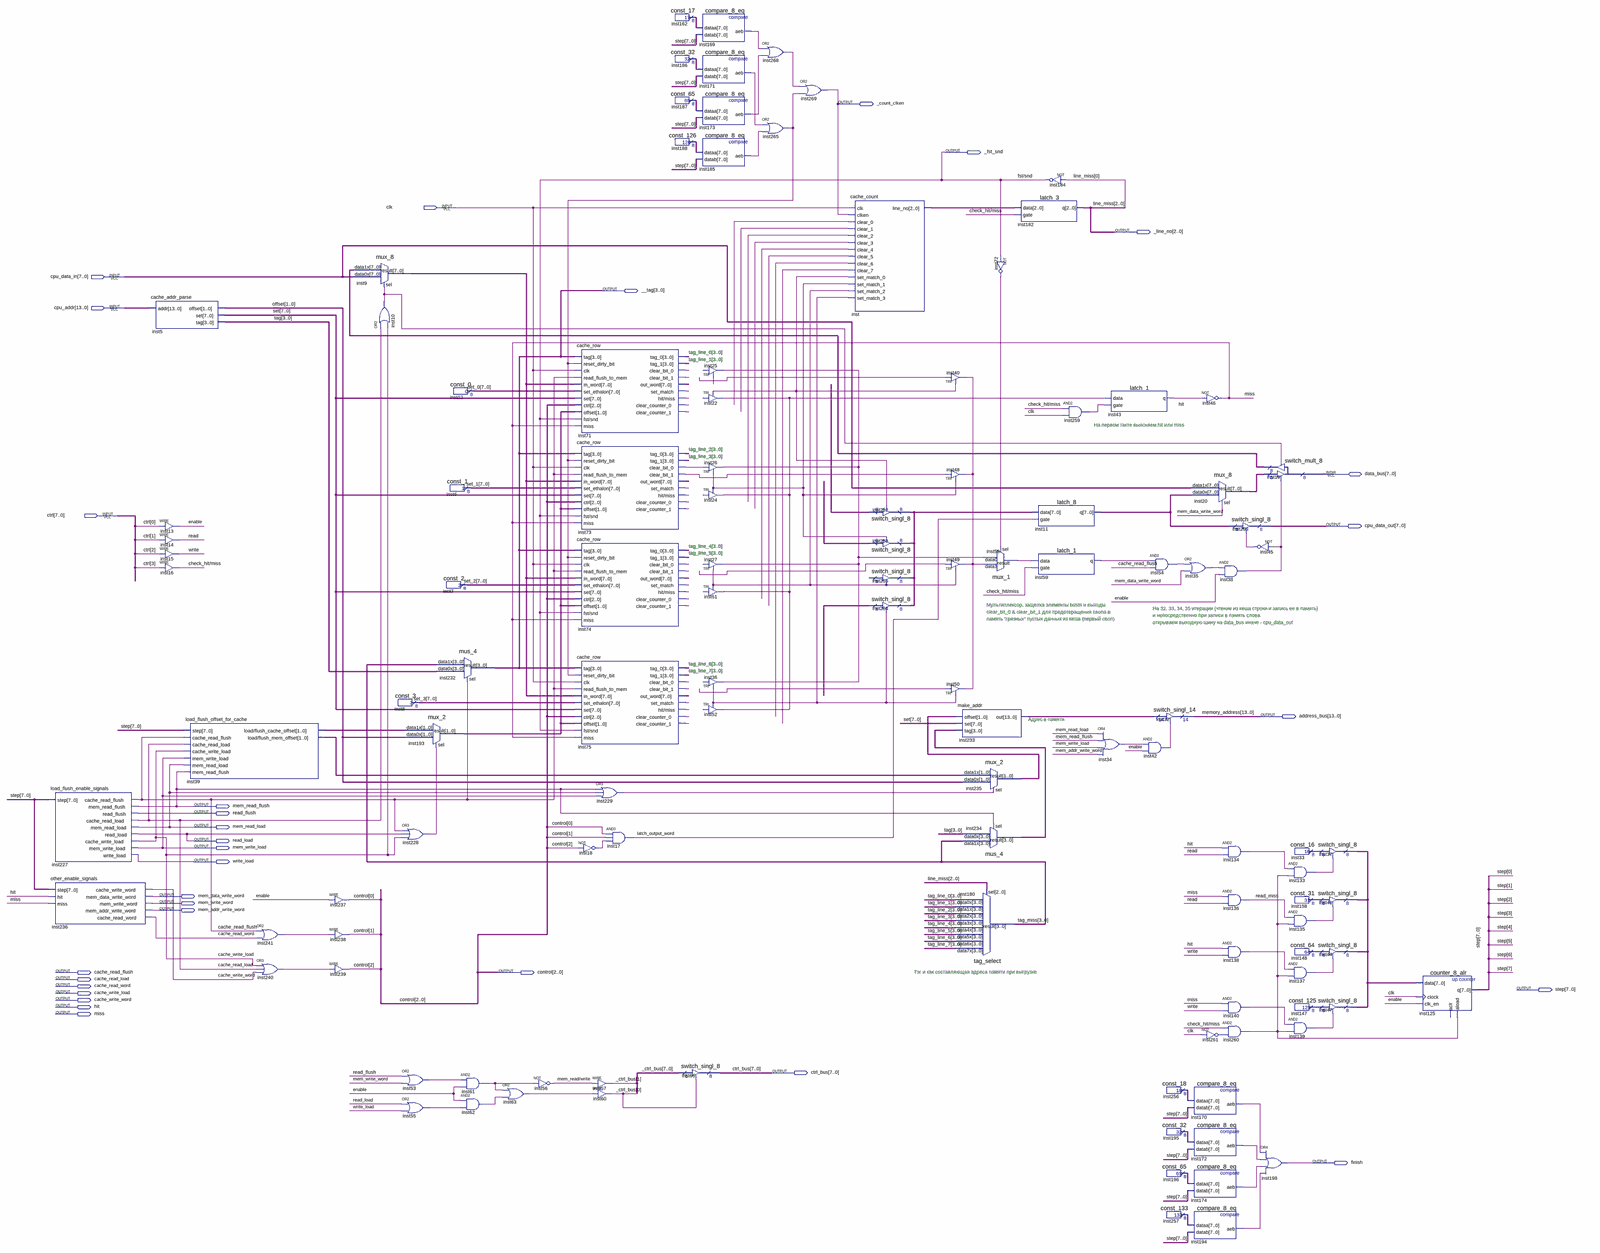
[diagram p0: schematic sheet, whole]
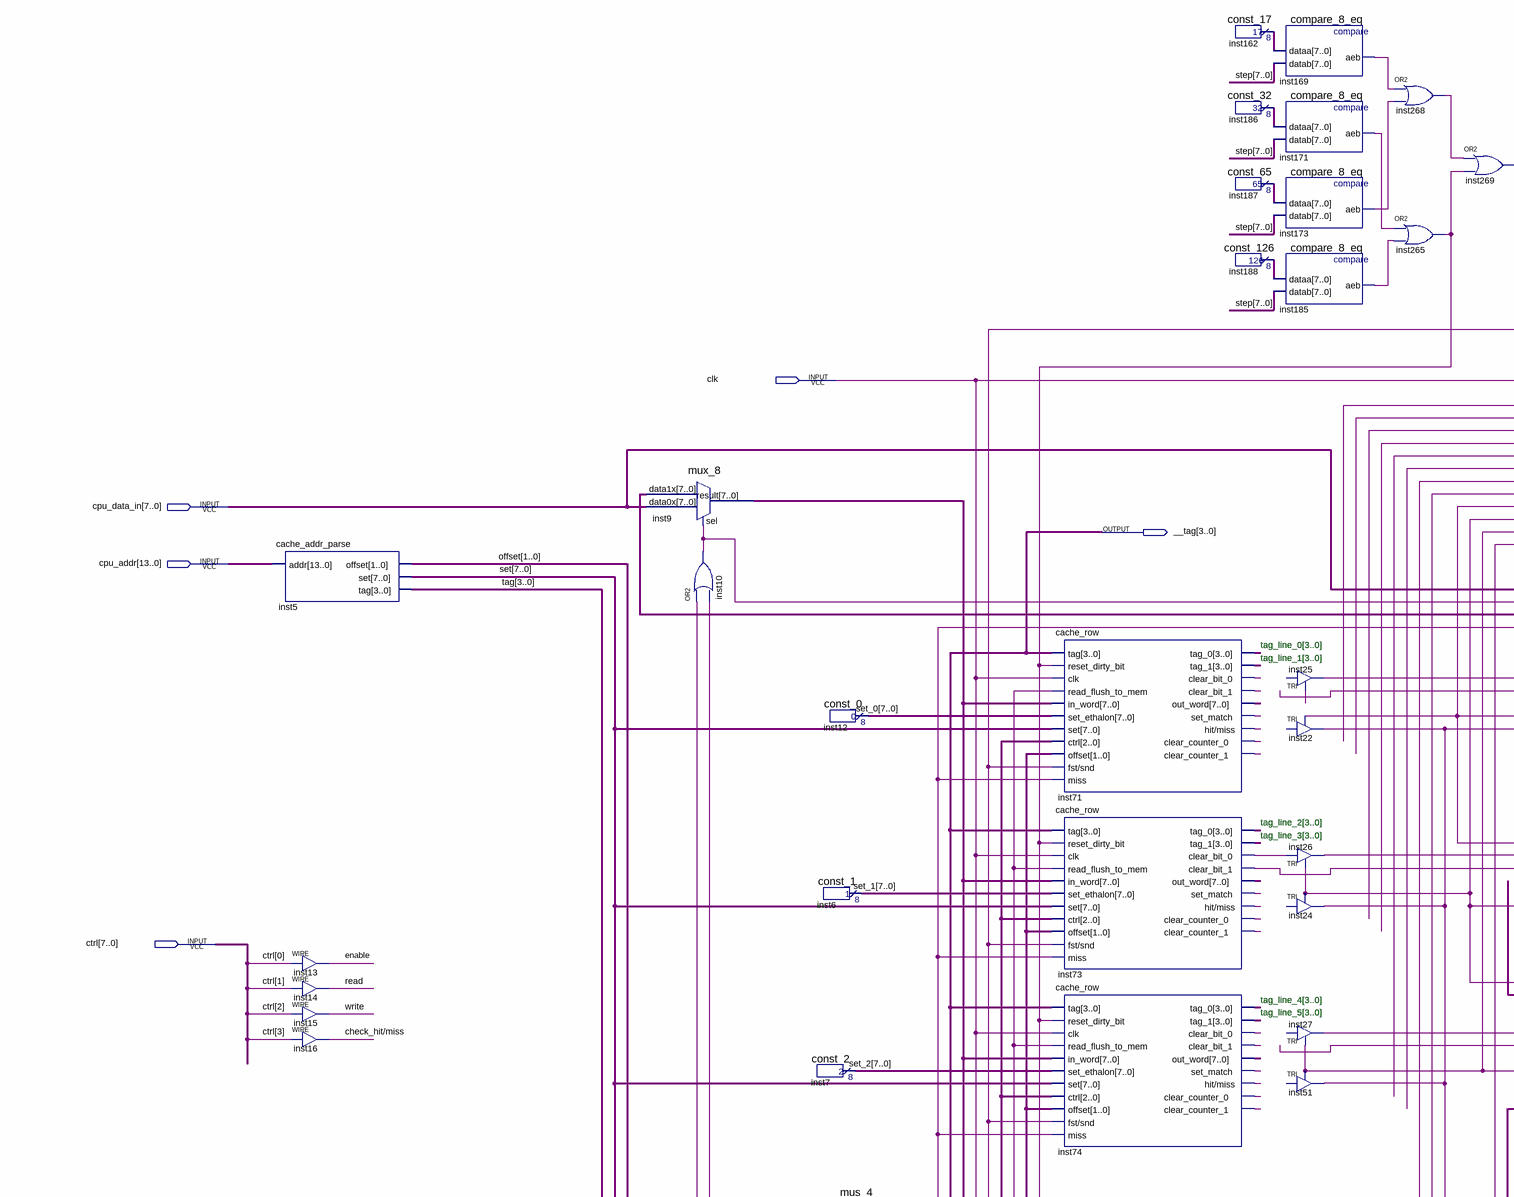
[diagram p1: schematic sheet, upper left part]
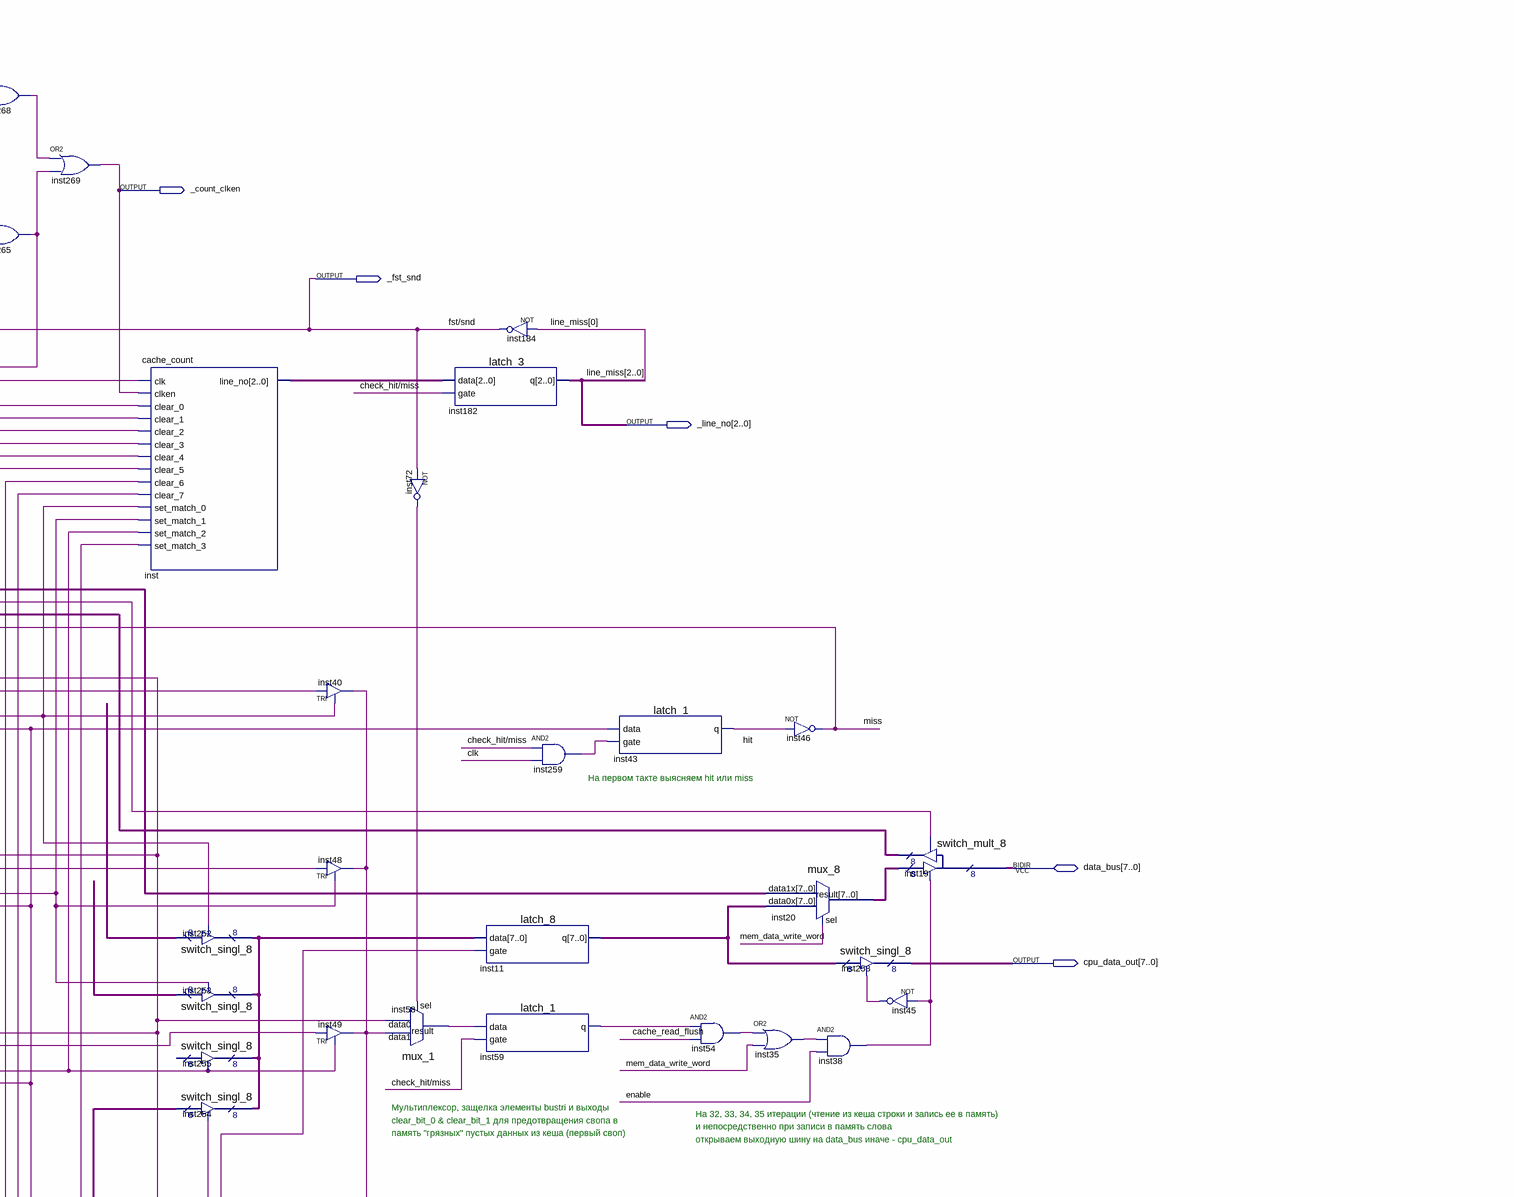
[diagram p2: schematic sheet, upper right part]
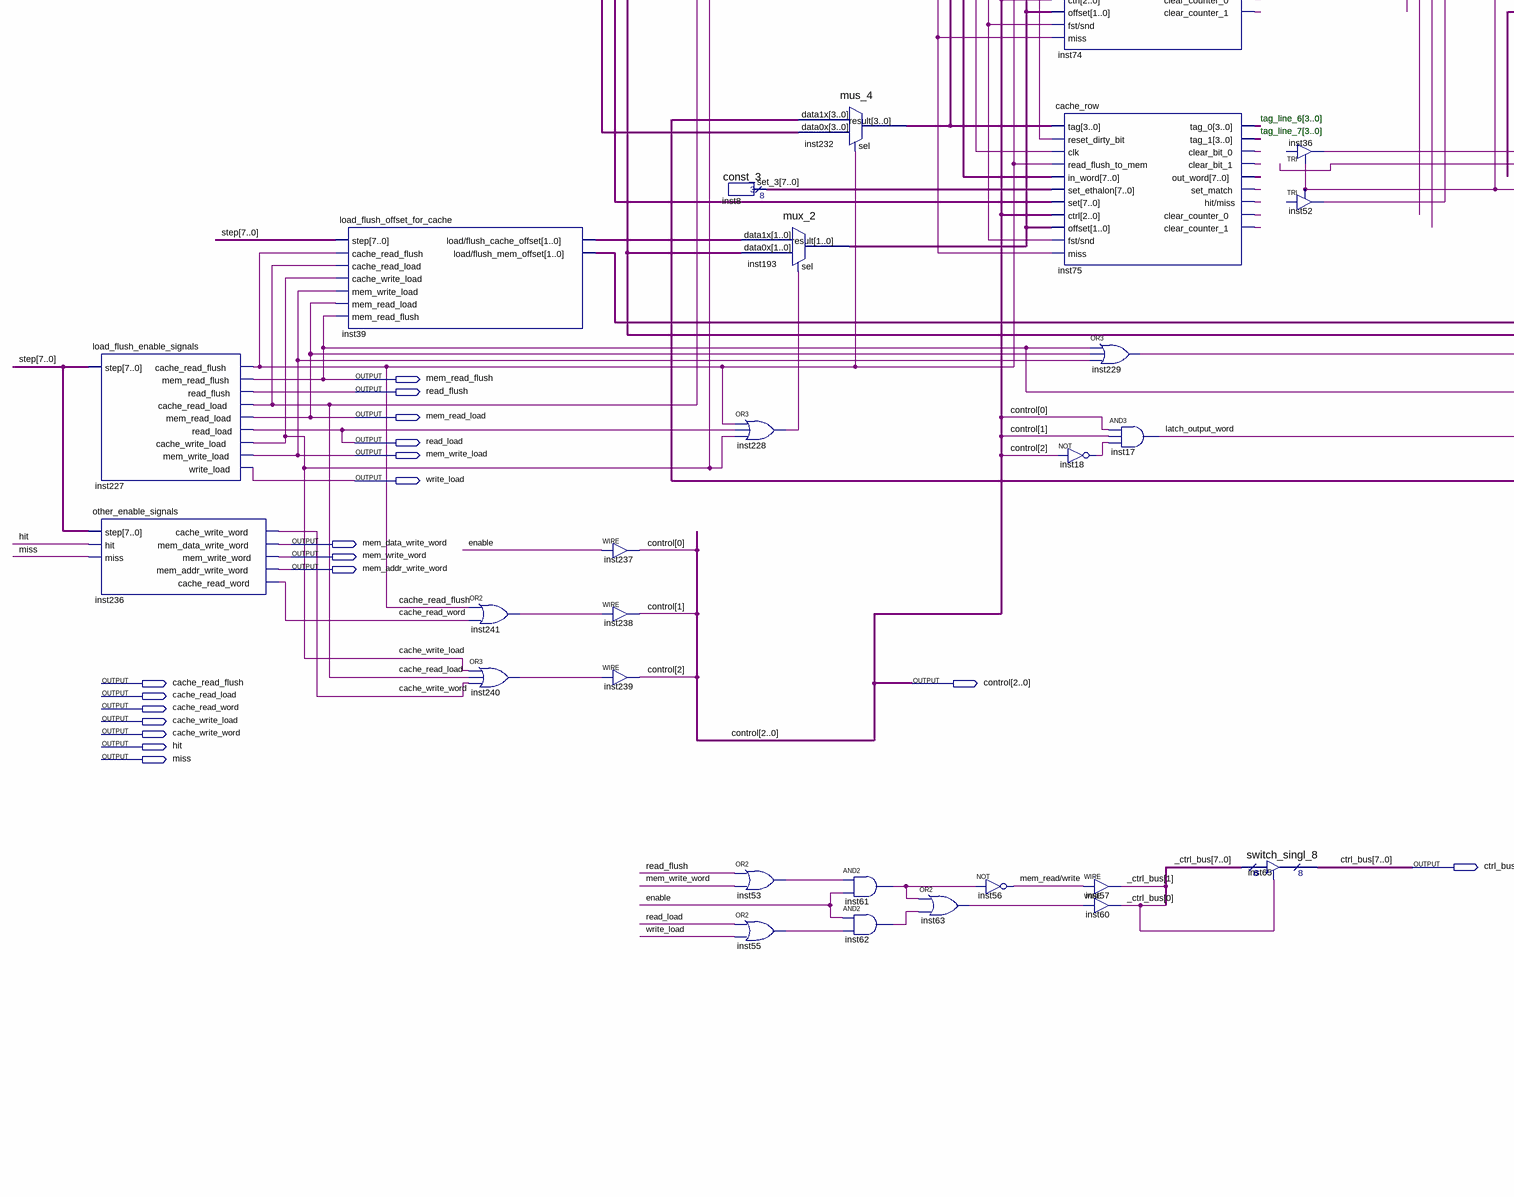
[diagram p3: schematic sheet, lower left part]
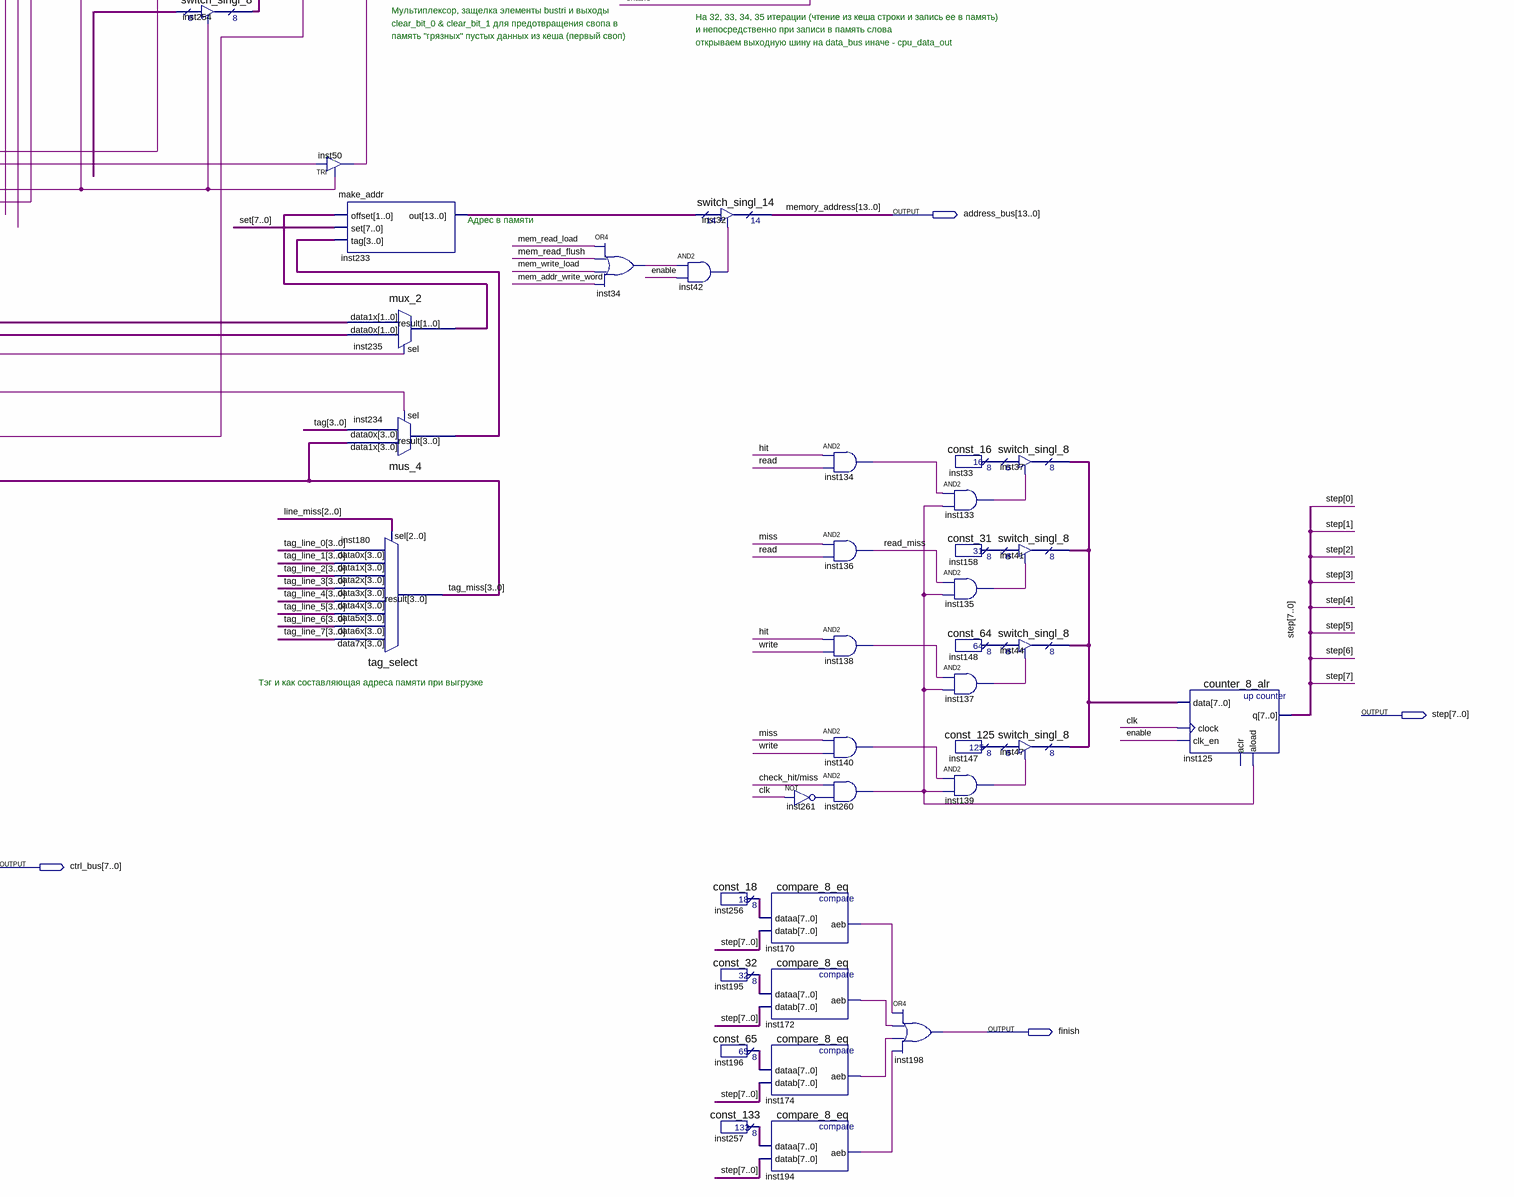
[diagram p4: schematic sheet, lower right part]
// Quartus schematic cache_all_pins.bdf as structural Verilog: 117 symbols, 31 pins
module cache_all_pins (
  input  clk,
  input  [7:0] cpu_data_in,
  input  [13:0] cpu_addr,
  input  [7:0] ctrl,
  inout  [7:0] data_bus,
  output _count_clken,
  output _fst_snd,
  output [2:0] _line_no,
  output [3:0] __tag,
  output [7:0] cpu_data_out,
  output [13:0] address_bus,
  output mem_read_flush,
  output read_flush,
  output mem_read_load,
  output read_load,
  output mem_write_load,
  output write_load,
  output mem_data_write_word,
  output mem_write_word,
  output mem_addr_write_word,
  output cache_read_flush,
  output [2:0] control,
  output cache_read_load,
  output cache_read_word,
  output [7:0] step,
  output cache_write_load,
  output cache_write_word,
  output hit,
  output miss,
  output [7:0] ctrl_bus,
  output finish
);

  wire \check_hit/miss , enable, inst10_out, inst18_out, inst22_out, inst25_out, inst34_out, inst35_out,
       inst38_out, inst40_out, inst42_out, inst45_out, inst53_out, inst54_out, inst55_out, inst58_result,
       inst59_q, inst61_out, inst62_out, inst63_out, inst71_clear_bit_0, inst71_clear_bit_1,
       inst71_clear_counter_0, inst71_clear_counter_1, inst71_hit_miss, inst71_set_match, inst72_out,
       inst73_clear_bit_0, inst73_clear_bit_1, inst73_clear_counter_0, inst73_clear_counter_1,
       inst73_hit_miss, inst73_set_match, inst74_clear_bit_0, inst74_clear_bit_1, inst74_clear_counter_0,
       inst74_clear_counter_1, inst74_hit_miss, inst74_set_match, inst75_clear_bit_0, inst75_clear_bit_1,
       inst75_clear_counter_0, inst75_clear_counter_1, inst75_hit_miss, inst75_set_match, inst133_out,
       inst134_out, inst135_out, inst137_out, inst138_out, inst139_out, inst140_out, inst169_aeb,
       inst170_aeb, inst171_aeb, inst172_aeb, inst173_aeb, inst174_aeb, inst185_aeb, inst194_aeb,
       inst228_out, inst229_out, inst240_out, inst241_out, inst259_out, inst260_out, inst261_out,
       inst265_out, inst268_out, latch_output_word, \mem_read/write , read, read_miss, undriven, undriven_2,
       undriven_3, undriven_4, undriven_5, undriven_6, undriven_7, undriven_8, undriven_9, undriven_10,
       undriven_11, undriven_12, undriven_13, undriven_15, undriven_17, undriven_19, write;
  wire [1:0] inst39_load_flush_cache_offset, inst39_load_flush_mem_offset, inst193_result, inst235_result,
       offset;
  wire [2:0] inst_line_no;
  wire [3:0] inst234_result, tag, tag_line_0, tag_line_1, tag_line_2, tag_line_3, tag_line_4, tag_line_5,
       tag_line_6, tag_line_7, tag_miss;
  wire [7:0] _ctrl_bus, inst9_result, inst11_q, inst19_result, inst20_result, inst33_result, inst37_tridata,
       inst71_out_word, inst73_out_word, inst74_out_word, inst75_out_word, inst147_result, inst148_result,
       inst158_result, inst162_result, inst186_result, inst187_result, inst188_result, inst195_result,
       inst196_result, inst252_tridata, inst256_result, inst257_result, set, set_0, set_1, set_2, set_3,
       undriven_14, undriven_16, undriven_18;
  wire [13:0] inst233_out;

  load_flush_enable_signals inst227 (
    .step(step), .cache_read_flush(cache_read_flush), .mem_read_flush(mem_read_flush),
    .read_flush(read_flush), .cache_read_load(cache_read_load), .mem_read_load(mem_read_load),
    .read_load(read_load), .cache_write_load(cache_write_load), .mem_write_load(mem_write_load),
    .write_load(write_load));
  other_enable_signals inst236 (
    .step(step), .hit(hit), .miss(miss), .cache_write_word(cache_write_word),
    .mem_data_write_word(mem_data_write_word), .mem_write_word(mem_write_word),
    .mem_addr_write_word(mem_addr_write_word), .cache_read_word(cache_read_word));
  cache_addr_parse inst5 (.addr(cpu_addr), .offset(offset), .set(set), .tag(tag));
  assign enable = ctrl[0];  // WIRE inst13
  assign read = ctrl[1];  // WIRE inst14
  assign write = ctrl[2];  // WIRE inst15
  assign \check_hit/miss  = ctrl[3];  // WIRE inst16
  load_flush_offset_for_cache inst39 (
    .step(step), .cache_read_flush(cache_read_flush), .cache_read_load(cache_read_load),
    .cache_write_load(cache_write_load), .mem_write_load(mem_write_load), .mem_read_load(mem_read_load),
    .mem_read_flush(mem_read_flush), .\load/flush_cache_offset (inst39_load_flush_cache_offset),
    .\load/flush_mem_offset (inst39_load_flush_mem_offset));
  or inst241 (inst241_out, cache_read_flush, cache_read_word);
  or inst240 (inst240_out, cache_write_load, cache_read_load, cache_write_word);
  assign control[0] = enable;  // WIRE inst237
  assign control[1] = inst241_out;  // WIRE inst238
  assign control[2] = inst240_out;  // WIRE inst239
  mux_8 inst9 (.data1x(inst19_result), .data0x(cpu_data_in), .sel(inst10_out), .result(inst9_result));
  or inst10 (inst10_out, cache_read_load, cache_write_load);
  const_3 inst8 (.result(set_3));
  or inst228 (inst228_out, cache_read_flush, read_load, cache_write_load);
  or inst53 (inst53_out, read_flush, mem_write_word);
  or inst55 (inst55_out, read_load, write_load);
  mux_2 inst193 (.data1x(inst39_load_flush_cache_offset), .data0x(offset), .sel(inst228_out), .result(inst193_result));
  const_0 inst12 (.result(set_0));
  const_1 inst6 (.result(set_1));
  const_2 inst7 (.result(set_2));
  mus_4 inst232 (.data1x(tag_miss), .data0x(tag), .sel(cache_read_flush), .result(__tag));
  and inst61 (inst61_out, inst53_out, enable);
  and inst62 (inst62_out, enable, inst55_out);
  or inst63 (inst63_out, inst61_out, inst62_out);
  not inst56 (\mem_read/write , inst61_out);
  cache_row inst71 (
    .tag(__tag), .reset_dirty_bit(inst265_out), .clk(clk), .read_flush_to_mem(cache_read_flush),
    .in_word(inst9_result), .set_ethalon(set_0), .set(set), .ctrl(control), .offset(inst193_result),
    .\fst/snd (_fst_snd), .miss(miss), .tag_0(tag_line_0), .tag_1(tag_line_1),
    .clear_bit_0(inst71_clear_bit_0), .clear_bit_1(inst71_clear_bit_1), .out_word(inst71_out_word),
    .set_match(inst71_set_match), .\hit/miss (inst71_hit_miss), .clear_counter_0(inst71_clear_counter_0),
    .clear_counter_1(inst71_clear_counter_1));
  cache_row inst73 (
    .tag(__tag), .reset_dirty_bit(inst265_out), .clk(clk), .read_flush_to_mem(cache_read_flush),
    .in_word(inst9_result), .set_ethalon(set_1), .set(set), .ctrl(control), .offset(inst193_result),
    .\fst/snd (_fst_snd), .miss(miss), .tag_0(tag_line_2), .tag_1(tag_line_3),
    .clear_bit_0(inst73_clear_bit_0), .clear_bit_1(inst73_clear_bit_1), .out_word(inst73_out_word),
    .set_match(inst73_set_match), .\hit/miss (inst73_hit_miss), .clear_counter_0(inst73_clear_counter_0),
    .clear_counter_1(inst73_clear_counter_1));
  cache_row inst74 (
    .tag(__tag), .reset_dirty_bit(inst265_out), .clk(clk), .read_flush_to_mem(cache_read_flush),
    .in_word(inst9_result), .set_ethalon(set_2), .set(set), .ctrl(control), .offset(inst193_result),
    .\fst/snd (_fst_snd), .miss(miss), .tag_0(tag_line_4), .tag_1(tag_line_5),
    .clear_bit_0(inst74_clear_bit_0), .clear_bit_1(inst74_clear_bit_1), .out_word(inst74_out_word),
    .set_match(inst74_set_match), .\hit/miss (inst74_hit_miss), .clear_counter_0(inst74_clear_counter_0),
    .clear_counter_1(inst74_clear_counter_1));
  cache_row inst75 (
    .tag(__tag), .reset_dirty_bit(inst265_out), .clk(clk), .read_flush_to_mem(cache_read_flush),
    .in_word(inst9_result), .set_ethalon(set_3), .set(set), .ctrl(control), .offset(inst193_result),
    .\fst/snd (_fst_snd), .miss(miss), .tag_0(tag_line_6), .tag_1(tag_line_7),
    .clear_bit_0(inst75_clear_bit_0), .clear_bit_1(inst75_clear_bit_1), .out_word(inst75_out_word),
    .set_match(inst75_set_match), .\hit/miss (inst75_hit_miss), .clear_counter_0(inst75_clear_counter_0),
    .clear_counter_1(inst75_clear_counter_1));
  or inst229 (inst229_out, mem_read_flush, mem_read_load, mem_write_load);
  not inst18 (inst18_out, control[2]);
  assign _ctrl_bus[1] = \mem_read/write ;  // WIRE inst57
  assign _ctrl_bus[0] = inst63_out;  // WIRE inst60
  and inst17 (latch_output_word, control[0], control[1], inst18_out);
  const_17 inst162 (.result(inst162_result));
  const_32 inst186 (.result(inst186_result));
  const_65 inst187 (.result(inst187_result));
  const_126 inst188 (.result(inst188_result));
  switch_singl_8 inst65 (.enabledt(_ctrl_bus[0]), .data(_ctrl_bus), .tridata(ctrl_bus));
  compare_8_eq inst169 (.dataa(inst162_result), .datab(step), .aeb(inst169_aeb));
  compare_8_eq inst171 (.dataa(inst186_result), .datab(step), .aeb(inst171_aeb));
  compare_8_eq inst173 (.dataa(inst187_result), .datab(step), .aeb(inst173_aeb));
  compare_8_eq inst185 (.dataa(inst188_result), .datab(step), .aeb(inst185_aeb));
  TRI inst25 (.OE(undriven_19), .OUT(inst25_out));  // open: IN
  TRI inst22 (.OE(undriven_3), .OUT(inst22_out));  // open: IN
  TRI inst26 (.IN(inst73_clear_bit_0), .OE(undriven_15), .OUT(inst25_out));
  TRI inst24 (.OE(undriven_15), .OUT(inst22_out));  // open: IN
  TRI inst27 (.OE(undriven_10), .OUT(inst25_out));  // open: IN
  TRI inst51 (.OE(undriven_10), .OUT(inst22_out));  // open: IN
  TRI inst36 (.OE(undriven_17), .OUT(inst25_out));  // open: IN
  TRI inst52 (.OE(undriven_17), .OUT(inst22_out));  // open: IN
  or inst268 (inst268_out, inst169_aeb, inst173_aeb);
  or inst265 (inst265_out, inst171_aeb, inst185_aeb);
  or inst269 (_count_clken, inst268_out, inst265_out);
  cache_count inst (
    .clk(clk), .clken(_count_clken), .clear_0(undriven), .clear_1(undriven_2), .clear_2(undriven_4),
    .clear_3(undriven_5), .clear_4(undriven_8), .clear_5(undriven_9), .clear_6(undriven_6),
    .clear_7(undriven_7), .set_match_0(undriven_3), .set_match_1(undriven_15), .set_match_2(undriven_10),
    .set_match_3(undriven_17), .line_no(inst_line_no));
  switch_singl_8 inst252 (.enabledt(undriven_3), .data(undriven_16), .tridata(inst252_tridata));
  switch_singl_8 inst253 (.enabledt(undriven_15), .data(undriven_14), .tridata(inst252_tridata));
  switch_singl_8 inst255 (.enabledt(undriven_10), .tridata(inst252_tridata));  // open: data
  switch_singl_8 inst254 (.enabledt(undriven_17), .data(undriven_18), .tridata(inst252_tridata));
  TRI inst40 (.IN(undriven_11), .OE(undriven_3), .OUT(inst40_out));
  TRI inst48 (.IN(inst73_clear_bit_1), .OE(undriven_15), .OUT(inst40_out));
  TRI inst49 (.IN(undriven_13), .OE(undriven_10), .OUT(inst40_out));
  TRI inst50 (.IN(undriven_12), .OE(undriven_17), .OUT(inst40_out));
  make_addr inst233 (.offset(inst235_result), .set(set), .tag(inst234_result), .out(inst233_out));
  tag_select inst180 (
    .data7x(tag_line_7), .data6x(tag_line_6), .data5x(tag_line_5), .data4x(tag_line_4), .data3x(tag_line_3),
    .data2x(tag_line_2), .data1x(tag_line_1), .data0x(tag_line_0), .sel(_line_no), .result(tag_miss));
  mux_1 inst58 (.data1(inst40_out), .data0(inst25_out), .sel(inst72_out), .result(inst58_result));
  mux_2 inst235 (.data1x(inst39_load_flush_mem_offset), .data0x(offset), .sel(inst229_out), .result(inst235_result));
  mus_4 inst234 (.data1x(tag_miss), .data0x(tag), .sel(mem_read_flush), .result(inst234_result));
  not inst72 (inst72_out, _fst_snd);
  latch_3 inst182 (.data(inst_line_no), .gate(\check_hit/miss ), .q(_line_no));
  latch_8 inst11 (.data(inst252_tridata), .gate(latch_output_word), .q(inst11_q));
  latch_1 inst59 (.data(inst58_result), .gate(\check_hit/miss ), .q(inst59_q));
  not inst184 (_fst_snd, _line_no[0]);
  and inst259 (inst259_out, \check_hit/miss , clk);
  latch_1 inst43 (.data(inst22_out), .gate(inst259_out), .q(hit));
  or inst34 (inst34_out, mem_read_load, mem_read_flush, mem_write_load, mem_addr_write_word);
  and inst54 (inst54_out, inst59_q, cache_read_flush);
  and inst42 (inst42_out, inst34_out, enable);
  switch_singl_14 inst32 (.enabledt(inst42_out), .data(inst233_out), .tridata(address_bus));
  const_18 inst256 (.result(inst256_result));
  const_32 inst195 (.result(inst195_result));
  const_65 inst196 (.result(inst196_result));
  const_133 inst257 (.result(inst257_result));
  not inst46 (miss, hit);
  mux_8 inst20 (.data1x(cpu_data_in), .data0x(inst11_q), .sel(mem_data_write_word), .result(inst20_result));
  or inst35 (inst35_out, inst54_out, mem_data_write_word);
  not inst261 (inst261_out, clk);
  compare_8_eq inst170 (.dataa(inst256_result), .datab(step), .aeb(inst170_aeb));
  compare_8_eq inst172 (.dataa(inst195_result), .datab(step), .aeb(inst172_aeb));
  compare_8_eq inst174 (.dataa(inst196_result), .datab(step), .aeb(inst174_aeb));
  compare_8_eq inst194 (.dataa(inst257_result), .datab(step), .aeb(inst194_aeb));
  switch_singl_8 inst258 (.enabledt(inst45_out), .data(inst11_q), .tridata(cpu_data_out));
  and inst38 (inst38_out, inst35_out, enable);
  and inst134 (inst134_out, hit, read);
  and inst136 (read_miss, miss, read);
  and inst138 (inst138_out, hit, write);
  and inst140 (inst140_out, miss, write);
  and inst260 (inst260_out, \check_hit/miss , inst261_out);
  not inst45 (inst45_out, inst38_out);
  or inst198 (finish, inst170_aeb, inst172_aeb, inst174_aeb, inst194_aeb);
  switch_mult_8 inst19 (
    .enabledt(inst38_out), .data(inst20_result), .enabletr(inst10_out), .result(inst19_result),
    .tridata(data_bus));
  const_16 inst33 (.result(inst33_result));
  and inst133 (inst133_out, inst134_out, inst260_out);
  const_31 inst158 (.result(inst158_result));
  and inst135 (inst135_out, read_miss, inst260_out);
  const_64 inst148 (.result(inst148_result));
  and inst137 (inst137_out, inst138_out, inst260_out);
  const_125 inst147 (.result(inst147_result));
  and inst139 (inst139_out, inst140_out, inst260_out);
  switch_singl_8 inst37 (.enabledt(inst133_out), .data(inst33_result), .tridata(inst37_tridata));
  switch_singl_8 inst41 (.enabledt(inst135_out), .data(inst158_result), .tridata(inst37_tridata));
  switch_singl_8 inst44 (.enabledt(inst137_out), .data(inst148_result), .tridata(inst37_tridata));
  switch_singl_8 inst47 (.enabledt(inst139_out), .data(inst147_result), .tridata(inst37_tridata));
  counter_8_alr inst125 (
    .data(inst37_tridata), .clock(clk), .clk_en(enable), .aload(inst260_out), .q(step));  // open: aclr

  // Other names for the same wires on the sheet: fst/snd = _fst_snd; line_miss[2:0] = _line_no;
  //   memory_address[13:0] = address_bus

  // Notes on the sheet:
  //   tag_line_0[3..0]
  //   tag_line_1[3..0]
  //   На первом такте выясняем hit или miss
  //   tag_line_2[3..0]
  //   tag_line_3[3..0]
  //   tag_line_4[3..0]
  //   tag_line_5[3..0]
  //   Мультиплексор, защелка элементы bustri и выходы
  //   На 32, 33, 34, 35 итерации (чтение из кеша строки и запись ее в память)
  //   clear_bit_0 & clear_bit_1 для предотвращения свопа в
  //   и непосредственно при записи в память слова
  //   память "грязных" пустых данных из кеша (первый своп)
  //   открываем выходную шину на data_bus иначе - cpu_data_out
  //   tag_line_6[3..0]
  //   tag_line_7[3..0]
  //   Адрес в памяти
  //   Тэг и как составляющая адреса памяти при выгрузке
endmodule
